# Altium project PowerTower_AdapterUltrazohm.PrjPcb (part 2 of 2)
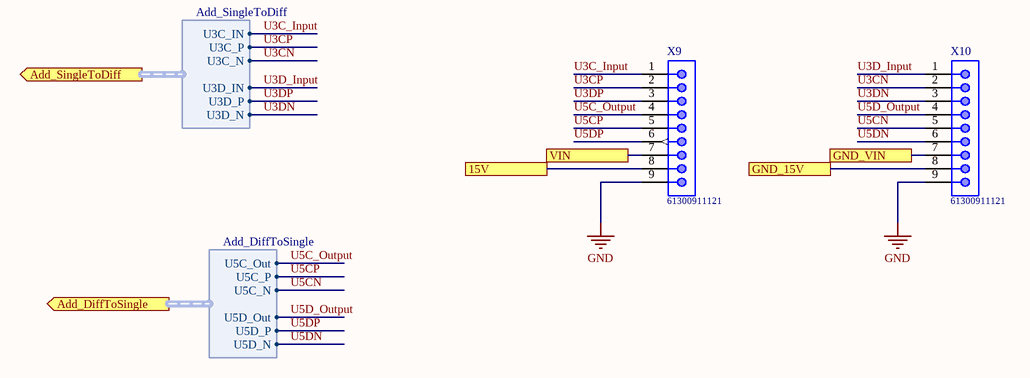
[diagram p8: Additional_PinHeader.SchDoc]

## Nets that join several sheets
3V3: PowerSupply (5 pins), DifferentialToSingle (C6.2 C7.2 U4.16 U5.16)
5V: PowerTowerConnectors (9 pins), PowerSupply (C2.2 C3.1 R60.2 U1.3), SingleToDifferential (C4.2 C5.2 U2.16 U3.16), AnalogValuePreparation (C20.2 IC3.4)
24V: PowerTowerConnectors (6 pins), PowerSupply (F1.1 F2.1 X11.3)
GND: PowerTowerConnectors (23 pins), PowerSupply (15 pins), UltrazohmConnectors (10 pins), DifferentialToSingle (8 pins), SingleToDifferential (8 pins), AnalogValuePreparation (10 pins), Additional_PinHeader (X9.9 X10.9)
F1_N: UltrazohmConnectors (X8.24), SingleToDifferential (R68.2)
F1_P: UltrazohmConnectors (X8.9), SingleToDifferential (R67.2)
F2_N: UltrazohmConnectors (X8.26), SingleToDifferential (R72.2)
F2_P: UltrazohmConnectors (X8.11), SingleToDifferential (R70.2)
F3_N: UltrazohmConnectors (X8.27), SingleToDifferential (R76.2)
F3_P: UltrazohmConnectors (X8.12), SingleToDifferential (R74.2)
F4_N: UltrazohmConnectors (X8.28), SingleToDifferential (R78.2)
F4_P: UltrazohmConnectors (X8.13), SingleToDifferential (R77.2)
F5_N: UltrazohmConnectors (X8.29), SingleToDifferential (R71.2)
F5_P: UltrazohmConnectors (X8.14), SingleToDifferential (R69.2)
F6_N: UltrazohmConnectors (X8.30), SingleToDifferential (R75.2)
F6_P: UltrazohmConnectors (X8.15), SingleToDifferential (R73.2)
G1: PowerTowerConnectors (X1.5), DifferentialToSingle (U4.3)
G1_N: UltrazohmConnectors (X8.17), DifferentialToSingle (R61.1 U4.1)
G1_P: UltrazohmConnectors (X8.2), DifferentialToSingle (R61.2 U4.2)
G2: PowerTowerConnectors (X2.5), DifferentialToSingle (U4.5)
G2_N: UltrazohmConnectors (X8.18), DifferentialToSingle (R63.1 U4.7)
G2_P: UltrazohmConnectors (X8.3), DifferentialToSingle (R63.2 U4.6)
G3: PowerTowerConnectors (X3.5), DifferentialToSingle (U4.11)
G3_N: UltrazohmConnectors (X8.19), DifferentialToSingle (R65.1 U4.9)
G3_P: UltrazohmConnectors (X8.4), DifferentialToSingle (R65.2 U4.10)
G4: PowerTowerConnectors (X1.6), DifferentialToSingle (U4.13)
G4_N: UltrazohmConnectors (X8.20), DifferentialToSingle (R66.1 U4.15)
G4_P: UltrazohmConnectors (X8.5), DifferentialToSingle (R66.2 U4.14)
G5: PowerTowerConnectors (X2.6), DifferentialToSingle (U5.3)
G5_N: UltrazohmConnectors (X8.21), DifferentialToSingle (R62.1 U5.1)
G5_P: UltrazohmConnectors (X8.6), DifferentialToSingle (R62.2 U5.2)
G6: PowerTowerConnectors (X3.6), DifferentialToSingle (U5.5)
G6_N: UltrazohmConnectors (X8.22), DifferentialToSingle (R64.1 U5.7)
G6_P: UltrazohmConnectors (X8.7), DifferentialToSingle (R64.2 U5.6)
I_U: PowerTowerConnectors (X4.2), UltrazohmConnectors (J1.A7)
I_V: PowerTowerConnectors (X5.2), UltrazohmConnectors (J1.A4)
I_W: PowerTowerConnectors (X6.2), UltrazohmConnectors (J1.A3)
IN_U3C: SingleToDifferential (U3.9), Additional_PinHeader (X9.1)
IN_U3D: SingleToDifferential (U3.15), Additional_PinHeader (X10.1)
IN_U5C_N: DifferentialToSingle (R79.1 U5.9), Additional_PinHeader (X10.5)
IN_U5C_P: DifferentialToSingle (R79.2 U5.10), Additional_PinHeader (X9.5)
IN_U5D_N: DifferentialToSingle (R80.1 U5.15), Additional_PinHeader (X10.6)
IN_U5D_P: DifferentialToSingle (R80.2 U5.14), Additional_PinHeader (X9.6)
NetR2_2: PowerTowerConnectors (R2.2 R3.1), SingleToDifferential (U2.15)
NetR4_2: PowerTowerConnectors (R4.2 R5.1), SingleToDifferential (U2.1)
NetR6_2: PowerTowerConnectors (R6.2 R7.1), SingleToDifferential (U2.9)
NetR8_2: PowerTowerConnectors (R8.2 R9.1), SingleToDifferential (U3.1)
NetR10_2: PowerTowerConnectors (R10.2 R11.1), SingleToDifferential (U2.7)
NetR12_2: PowerTowerConnectors (R12.2 R13.1), SingleToDifferential (U3.7)
NetX8_1: UltrazohmConnectors (X8.1), Additional_PinHeader (X9.7)
NetX8_10: UltrazohmConnectors (X8.10), Additional_PinHeader (X9.8)
NetX8_16: UltrazohmConnectors (X8.16), Additional_PinHeader (X10.7)
NetX8_25: UltrazohmConnectors (X8.25), Additional_PinHeader (X10.8)
Out_U: UltrazohmConnectors (J1.B7), AnalogValuePreparation (C21.1 IC3.7 R51.2)
Out_U3C_N: SingleToDifferential (R82.2), Additional_PinHeader (X10.2)
Out_U3C_P: SingleToDifferential (R81.2), Additional_PinHeader (X9.2)
Out_U3D_N: SingleToDifferential (R84.2), Additional_PinHeader (X10.3)
Out_U3D_P: SingleToDifferential (R83.2), Additional_PinHeader (X9.3)
Out_U5C: DifferentialToSingle (U5.11), Additional_PinHeader (X9.4)
Out_U5D: DifferentialToSingle (U5.13), Additional_PinHeader (X10.4)
Out_UZK: UltrazohmConnectors (J1.A1), AnalogValuePreparation (C16.2 IC3.1 R27.2)
Out_V: UltrazohmConnectors (J1.B4), AnalogValuePreparation (C17.1 IC3.14 R21.1)
Out_W: UltrazohmConnectors (J1.B3), AnalogValuePreparation (C22.2 IC3.8 R54.1)
UZK+: PowerTowerConnectors (X7.1), AnalogValuePreparation (R14.1)
UZK-: PowerTowerConnectors (X7.2), AnalogValuePreparation (R16.1)
Volt_U_Bot: PowerTowerConnectors (X1.2), AnalogValuePreparation (R30.1)
Volt_U_Top: PowerTowerConnectors (X1.1), AnalogValuePreparation (R28.1)
Volt_V_Bot: PowerTowerConnectors (X2.2), AnalogValuePreparation (R34.1)
Volt_V_Top: PowerTowerConnectors (X2.1), AnalogValuePreparation (R32.1)
Volt_W_Bot: PowerTowerConnectors (X3.2), AnalogValuePreparation (R38.1)
Volt_W_Top: PowerTowerConnectors (X3.1), AnalogValuePreparation (R36.1)